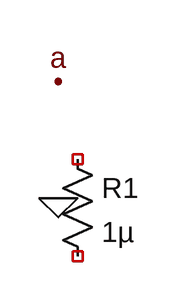
[diagram p0: schematic micro_cp1252.asc]
micro_cp1252.asc, the LTspice schematic file:
Version 4
SHEET 1 880 680
FLAG 96 96 a
FLAG 96 192 0
SYMBOL res 96 144 R0
SYMATTR InstName R1
SYMATTR Value 1µ

The netlist it stands for:
* micro_cp1252.asc
R1 NC_01 NC_02 1µ
.backanno
.end